# Altium schematic sheet 03_PCM5102A.SchDoc
size A4
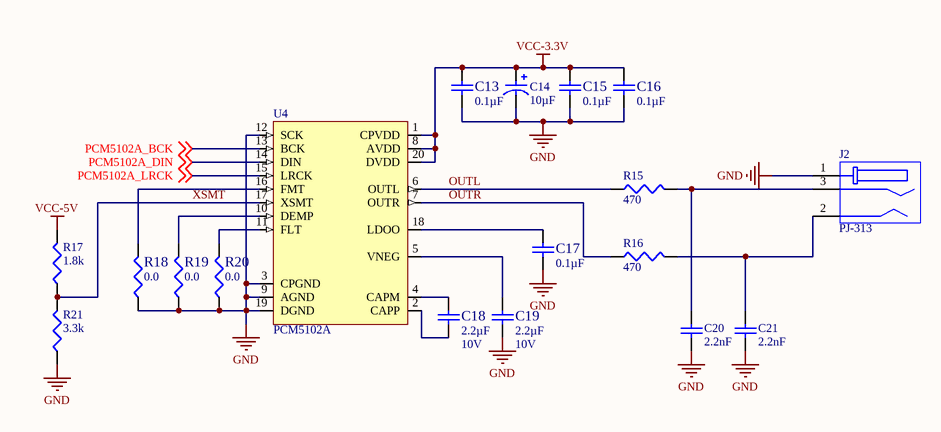
[diagram p0: 03_PCM5102A.SchDoc]

## Parts
C13  Capacitance: 0.1µF  [RAD-0.1]  (hidden comment: CC0603KRX7R9BB104)
C14  Capacitance: 10µF  [RB2-5]  (hidden comment: EEE-1HA100WR)
C15  Capacitance: 0.1µF  [RAD-0.1]  (hidden comment: CC0603KRX7R9BB104)
C16  Capacitance: 0.1µF  [RAD-0.1]  (hidden comment: CC0603KRX7R9BB104)
C17  Capacitance: 0.1µF  [RAD-0.1]  (hidden comment: CC0603KRX7R9BB104)
C18  Capacitance: 2.2µF  Voltage - Rated: 10V  [RB2-5]  (hidden comment: LMK107B7225KA-T)
C19  Capacitance: 2.2µF  Voltage - Rated: 10V  [RB2-5]  (hidden comment: LMK107B7225KA-T)
C20  2.2nF  [RAD-0.1]
C21  2.2nF  [RAD-0.1]
J2  PJ-313  [PJ-313]
R15  Resistance (Ohms): 470  [AXIAL-0.3]  (hidden comment: ERJ-3EKF4700V)
R16  Resistance (Ohms): 470  [AXIAL-0.3]  (hidden comment: ERJ-3EKF4700V)
R17  Resistance (Ohms): 1.8k  [AXIAL-0.3]  (hidden comment: ERJ-3GEYJ182V)
R18  Resistance (Ohms): 0.0  [AXIAL-0.3]  (hidden comment: RC0603JR-070RL)
R19  Resistance (Ohms): 0.0  [AXIAL-0.3]  (hidden comment: RC0603JR-070RL)
R20  Resistance (Ohms): 0.0  [AXIAL-0.3]  (hidden comment: RC0603JR-070RL)
R21  Resistance (Ohms): 3.3k  [AXIAL-0.3]  (hidden comment: ERJ-3GEYJ332V)
U4  PCM5102A  [TSSOP-20-1]

## Nets
GND: C13.2 C14.2(Anode) C15.2 C16.2 C17.2 C19.2 C20.2 C21.2 J2.1 R18.1 R19.1 R20.1 R21.1 U4.3(CPGND) U4.9(AGND) U4.12(SCK) U4.19(DGND)
VCC-3.3V: C13.1 C14.1(Cathode) C15.1 C16.1 U4.1(CPVDD) U4.8(AVDD) U4.20(DVDD)
VCC-5V: R17.2
OUTL: R15.1 U4.6(OUTL)
OUTR: R16.1 U4.7(OUTR)
PCM5102A_BCK: U4.13(BCK) ; off-sheet PCM5102A_BCK
PCM5102A_DIN: U4.14(DIN) ; off-sheet PCM5102A_DIN
PCM5102A_LRCK: U4.15(LRCK) ; off-sheet PCM5102A_LRCK
XSMT: R17.1 R21.2 U4.17(XSMT)
NetC17_1: C17.1 U4.18(LDOO)
NetC18_1: C18.1 U4.4(CAPM)
NetC18_2: C18.2 U4.2(CAPP)
NetC19_1: C19.1 U4.5(VNEG)
NetC20_1: C20.1 J2.3 R15.2
NetC21_1: C21.1 J2.2 R16.2
NetR18_2: R18.2 U4.16(FMT)
NetR19_2: R19.2 U4.10(DEMP)
NetR20_2: R20.2 U4.11(FLT)

## Library data of the parts
C13 C15-C17 = CC0603KRX7R9BB104: CAP CER 0.1UF 50V 10% X7R 0603; Manufacturer: Yageo; Supplier 1: Digi-Key; Supplier Part Number 1: 311-1344-1-ND; Manufacturer Part Number: CC0603KRX7R9BB104; RoHS: RoHS Compliant; Category: Capacitors; Stock 1: 63780; Pricing 1: 10=0.027, 100=0.0123, 500=0.00858, 1000=0.00669 (USD); Tolerance: ±10%; Temperature Coefficient: X7R; Mounting Type: Surface Mount, MLCC; Operating Temperature: -55°C ~ 125°C; Applications: General Purpose; Ratings: -; Package / Case: 0603 (1608 Metric); Size / Dimension: 0.063" L x 0.031" W (1.60mm x 0.80mm); Height - Seated (Max): -; Thickness (Max): 0.031" (0.80mm); Lead Spacing: -; Features: -; Packaging: Cut Tape (CT); Lead Style: -; ComponentLink1URL: http://www.yageo.com/documents/recent/UPY-GPHC_X7R_6.3V-to-50V_8.pdf; ComponentLink1Description: http://www.yageo.com/documents/recent/UPY-GPHC_X7R_6.3V-to-50V_8.pdf; Voltage - Rated: 50V
C14 = EEE-1HA100WR: CAP ALUM 10UF 50V 20% SMD; Manufacturer: Panasonic Electronic Components; Lifetime @ Temp.: 1000 Hrs @ 85°C; Ripple Current: 27mA; Surface Mount Land Size: 0.209" L x 0.209" W (5.30mm x 5.30mm); Supplier 1: Digi-Key; Supplier Part Number 1: PCE3915CT-ND; Manufacturer Part Number: EEE-1HA100WR; RoHS: RoHS Compliant; Category: Capacitors; Stock 1: 3860; Pricing 1: 1=0.44, 10=0.345, 25=0.2904, 50=0.249, 100=0.2076, 250=0.15568, 500=0.13284 (USD); Packaging: Cut Tape (CT); Tolerance: ±20%; Voltage Rating: 50V; ESR (Equivalent Series Resistance): -; Operating Temperature: -40°C ~ 85°C; Type: -; Applications: Automotive; Impedance: -; Lead Spacing: -; Size / Dimension: 0.197" Dia (5.00mm); Height - Seated (Max): 0.213" (5.40mm); Mounting Type: Surface Mount; Package / Case: Radial, Can - SMD; ComponentLink1URL: http://industrial.panasonic.com/www-cgi/jvcr13pz.cgi?E+PZ+3+ABA0002+EEE1HA100WR+7+WW; ComponentLink1Description: http://industrial.panasonic.com/www-cgi/jvcr13pz.cgi?E+PZ+3+ABA0002+EEE1HA100WR+7+WW
C18 C19 = LMK107B7225KA-T: CAP CER 2.2UF 10V 10% X7R 0603; Manufacturer: Taiyo Yuden; Supplier 1: Digi-Key; Supplier Part Number 1: 587-2983-1-ND; Manufacturer Part Number: LMK107B7225KA-T; RoHS: RoHS Compliant; Category: Capacitors; Stock 1: 15080; Pricing 1: 1=0.32, 10=0.24, 50=0.14, 100=0.112, 250=0.08, 500=0.0544, 1000=0.044 (USD); Tolerance: ±10%; Temperature Coefficient: X7R; Mounting Type: Surface Mount, MLCC; Operating Temperature: -55°C ~ 125°C; Applications: General Purpose; Ratings: -; Package / Case: 0603 (1608 Metric); Size / Dimension: 0.063" L x 0.031" W (1.60mm x 0.80mm); Height - Seated (Max): -; Thickness (Max): 0.035" (0.90mm); Lead Spacing: -; Features: -; Packaging: Cut Tape (CT); Lead Style: -; ComponentLink1URL: http://www.yuden.co.jp/or/product/category/capacitor/LMK107B7225KA-T.pdf; ComponentLink1Description: http://www.yuden.co.jp/or/product/category/capacitor/LMK107B7225KA-T.pdf
C20 C21 = C0603C222K5RACTU: CAP CER 2200PF 50V 10% X7R 0603; Manufacturer: Kemet; Supplier 1: Digi-Key; Supplier Part Number 1: 399-1085-1-ND; Manufacturer Part Number: C0603C222K5RACTU; RoHS: RoHS Compliant; Category: Capacitors; Stock 1: 114644; Pricing 1: 1=0.1, 10=0.029, 25=0.0208, 50=0.016, 100=0.0135, 250=0.011, 1000=0.0072 (USD); Packaging: Cut Tape (CT); Capacitance: 2200pF; Tolerance: ±10%; Voltage - Rated: 50V; Temperature Coefficient: X7R; Mounting Type: Surface Mount, MLCC; Operating Temperature: -55°C ~ 125°C; Applications: General Purpose; Ratings: -; Package / Case: 0603 (1608 Metric); Size / Dimension: 0.063" L x 0.031" W (1.60mm x 0.80mm); Height - Seated (Max): -; Thickness (Max): 0.034" (0.87mm); Lead Spacing: -; Features: -; Lead Style: -; ComponentLink1URL: http://www.kemet.com/docfinder?Partnumber=C0603C222K5RACTU; ComponentLink1Description: http://www.kemet.com/docfinder?Partnumber=C0603C222K5RACTU
J2 = PJ-313: 3.5mm Audio Jack
R15 R16 = ERJ-3EKF4700V: RES 470 OHM 1% 1/10W 0603 SMD; Manufacturer: Panasonic Electronic Components; Power (Watts): 0.1W, 1/10W; Temperature Coefficient: ±100ppm/°C; Supplier 1: Digi-Key; Supplier Part Number 1: P470HCT-ND; Manufacturer Part Number: ERJ-3EKF4700V; RoHS: RoHS Compliant; Category: Resistors; Stock 1: 189242; Pricing 1: 1=0.1, 50=0.015, 100=0.0114, 250=0.00844, 500=0.00624, 1000=0.00416, 2500=0.00351 (USD); Packaging: Cut Tape (CT); Tolerance: ±1%; Composition: Thick Film; Features: Automotive AEC-Q200; Operating Temperature: -55°C ~ 155°C; Package / Case: 0603 (1608 Metric); Supplier Device Package: 0603; Size / Dimension: 0.063" L x 0.031" W (1.60mm x 0.80mm); Height: 0.022" (0.55mm); Number of Terminations: 2; ComponentLink1URL: http://industrial.panasonic.com/www-cgi/jvcr13pz.cgi?E+PZ+3+AOA0002+ERJ3EKF4700V+7+WW; ComponentLink1Description: http://industrial.panasonic.com/www-cgi/jvcr13pz.cgi?E+PZ+3+AOA0002+ERJ3EKF4700V+7+WW
R17 = ERJ-3GEYJ182V: RES 1.8K OHM 1/10W 5% 0603 SMD; Manufacturer: Panasonic Electronic Components; Power (Watts): 0.1W, 1/10W; Temperature Coefficient: ±200ppm/°C; Supplier 1: Digi-Key; Manufacturer Part Number: ERJ-3GEYJ182V; RoHS: RoHS Compliant; Category: Resistors; Stock 1: 164571; Pricing 1: 1=0.1, 50=0.0092, 100=0.007, 250=0.0052, 500=0.00384, 1000=0.00256 (USD); Packaging: Cut Tape (CT); Tolerance: ±5%; Composition: Thick Film; Features: -; Package / Case: 0603 (1608 Metric); Supplier Device Package: 0603; Size / Dimension: 0.063" L x 0.031" W (1.60mm x 0.80mm); Height: 0.022" (0.55mm); Number of Terminations: 2; ComponentLink1URL: http://industrial.panasonic.com/www-cgi/jvcr13pz.cgi?E+PZ+3+AOA0001+ERJ3GEYJ182V+7+WW; ComponentLink1Description: http://industrial.panasonic.com/www-cgi/jvcr13pz.cgi?E+PZ+3+AOA0001+ERJ3GEYJ182V+7+WW; Supplier Part Number 1: P1.8KGCT-ND
R18-R20 = RC0603JR-070RL: RES 0.0 OHM 1/10W 0603 SMD; Manufacturer: Yageo; Power (Watts): 0.1W, 1/10W; Tolerance: Jumper; Supplier 1: Digi-Key; Supplier Part Number 1: 311-0.0GRCT-ND; Manufacturer Part Number: RC0603JR-070RL; RoHS: RoHS Compliant; Category: Resistors; Stock 1: 405251; Pricing 1: 10=0.01, 100=0.0048, 500=0.00294, 1000=0.00207 (USD); Composition: Thick Film; Features: -; Temperature Coefficient: -; Package / Case: 0603 (1608 Metric); Size / Dimension: 0.063" L x 0.031" W (1.60mm x 0.80mm); Height: 0.022" (0.55mm); Number of Terminations: 2; Packaging: Cut Tape (CT); ComponentLink1URL: http://www.yageo.com/documents/recent/PYu-RC0603_51_RoHS_L_4.pdf; ComponentLink1Description: http://www.yageo.com/documents/recent/PYu-RC0603_51_RoHS_L_4.pdf
R21 = ERJ-3GEYJ332V: RES 3.3K OHM 5% 1/10W 0603 SMD; Manufacturer: Panasonic Electronic Components; Power (Watts): 0.1W, 1/10W; Temperature Coefficient: ±200ppm/°C; Supplier 1: Digi-Key; Supplier Part Number 1: P3.3KGCT-ND; Manufacturer Part Number: ERJ-3GEYJ332V; RoHS: RoHS Compliant; Category: Resistors; Stock 1: 491357; Pricing 1: 1=0.1, 50=0.0126, 100=0.0096, 250=0.00716, 500=0.00528, 1000=0.00352, 2500=0.00297 (USD); Packaging: Cut Tape (CT); Tolerance: ±5%; Composition: Thick Film; Features: Automotive AEC-Q200; Operating Temperature: -55°C ~ 155°C; Package / Case: 0603 (1608 Metric); Supplier Device Package: 0603; Size / Dimension: 0.063" L x 0.031" W (1.60mm x 0.80mm); Height: 0.022" (0.55mm); Number of Terminations: 2; ComponentLink1URL: http://industrial.panasonic.com/www-cgi/jvcr13pz.cgi?E+PZ+3+AOA0001+ERJ3GEYJ332V+7+WW; ComponentLink1Description: http://industrial.panasonic.com/www-cgi/jvcr13pz.cgi?E+PZ+3+AOA0001+ERJ3GEYJ332V+7+WW
U4 = PCM5102APWR: IC DAC 16/24/32BIT SRL 20TSSOP; Manufacturer: Texas Instruments; Number of Bits: 16, 24, 32; Data Interface: PCM, Serial; Number of Converters: 2; Voltage Supply Source: Analog and Digital; Number of Outputs and Type: 2 Voltage; Sampling Rate (Per Second): 8k ~ 384k; Supplier 1: Digi-Key; Supplier Part Number 1: 296-36707-1-ND; Manufacturer Part Number: PCM5102APWR; RoHS: RoHS Compliant; Category: Integrated Circuits (ICs); Stock 1: 4057; Pricing 1: 1=5.44, 10=4.876, 25=4.3848, 100=3.9879, 250=3.60992, 500=3.2319, 750=2.92951, 1000=2.7216 (USD); Packaging: Cut Tape (CT); Settling Time: -; Operating Temperature: -25°C ~ 85°C; Mounting Type: Surface Mount; Package / Case: 20-TSSOP (0.173", 4.40mm Width); Supplier Device Package: 20-TSSOP; ComponentLink1URL: http://www.ti.com/lit/ds/symlink/pcm5102a.pdf; ComponentLink1Description: http://www.ti.com/lit/ds/symlink/pcm5102a.pdf